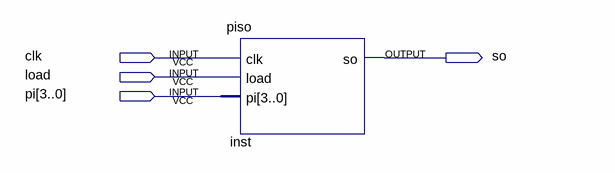
[diagram p0: schematic sheet]
// Quartus schematic piso2.bdf as structural Verilog: 1 symbols, 4 pins
module piso2 (
  input  clk,
  input  load,
  input  [3:0] pi,
  output so
);

  piso inst (.clk(clk), .load(load), .pi(pi), .so(so));
endmodule
